# Altium schematic sheet Accelerometer.SchDoc: Motor Vibration
size A4; Organization: NTUST EE-305; Address1: No.43, Sec. 4, Keelung Rd.; Address2: Da’an Dist.; Address3: Taipei 106; Address4: Taiwan (R.O.C.); DocumentNumber: 2; Revision: 3.0; SheetNumber: 9; SheetTotal: 9
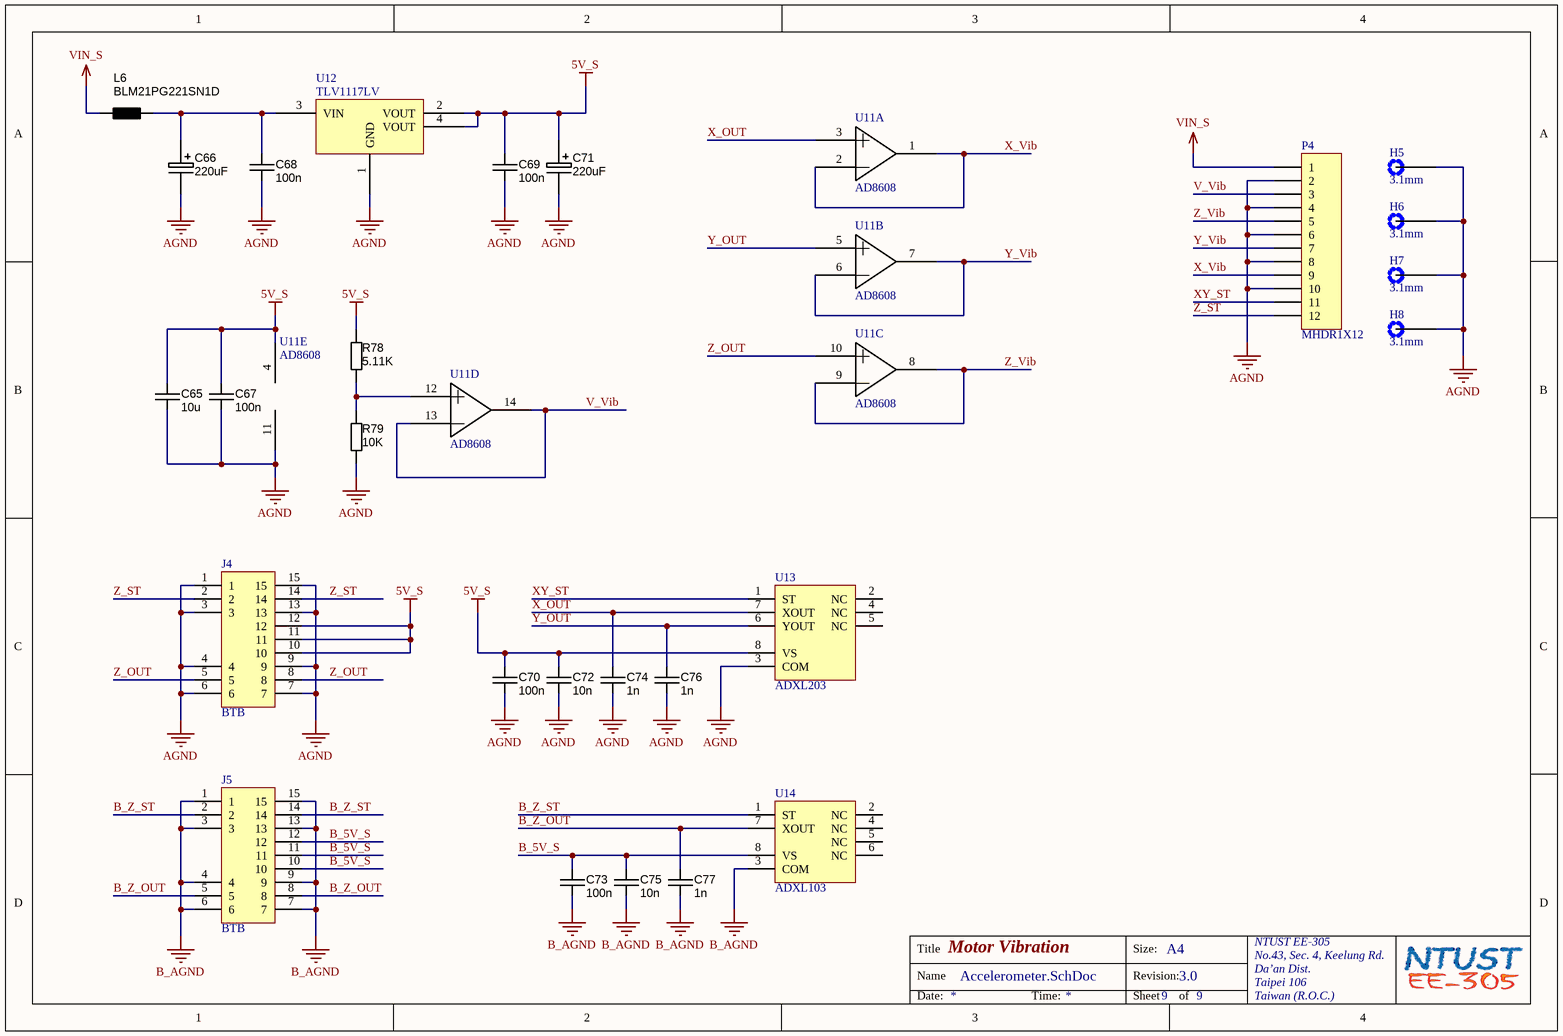
[diagram p0: Accelerometer.SchDoc]

## Parts
C65  10u  [CAPC1005N]
C66  220uF  [CAP_ELEC_SIZE_D8]
C67  100n  [CAPC1005N]
C68  100n  [CAPC1005N]
C69  100n  [CAPC1005N]
C70  100n  [CAPC1005N]
C71  220uF  [CAP_ELEC_SIZE_D8]
C72  10n  [CAPC1005N]
C73  100n  [CAPC1005N]
C74  1n  [CAPC1005N]
C75  10n  [CAPC1005N]
C76  1n  [CAPC1005N]
C77  1n  [CAPC1005N]
H5  3.1mm  [Holes]
H6  3.1mm  [Holes]
H7  3.1mm  [Holes]
H8  3.1mm  [Holes]
J4  BTB  [BTB_B]
J5  BTB  [BTB_S]
L6  BLM21PG221SN1D  [INDC2012N]
P4  MHDR1X12  [MHDR1X12]
R78  5.11K  [RESC1005N]
R79  10K  [RESC1005N]
U11  AD8608  [MCHP-TSSOP-ST14_L]  (parts A,B,C,D,E of 5)
U12  TLV1117LV  [SOT-223-DB3_N]
U13  ADXL203  [LCC8-E-8-1]
U14  ADXL103  [LCC8-E-8-1]

## Nets
5V_S: C65.1 C67.1 C69.1 C70.1 C71.1 C72.1 J4.10 J4.11 J4.12 R78.1 U11.4(VDD) U12.2(VOUT) U12.4(VOUT) U13.8(VS)
AGND: C65.2 C66.2 C67.2 C68.2 C69.2 C70.2 C71.2 C72.2 C74.2 C76.2 H5.0 H6.0 H7.0 H8.0 J4.1 J4.3 J4.4 J4.6 J4.7 J4.9 J4.13 J4.15 P4.2 P4.4 P4.6 P4.8 P4.10 R79.2 U11.11(GND) U12.1(GND) U13.3(COM)
B_AGND: C73.2 C75.2 C77.2 J5.1 J5.3 J5.4 J5.6 J5.7 J5.9 J5.13 J5.15 U14.3(COM)
VIN_S: L6.1 P4.1
B_5V_S: C73.1 C75.1 J5.10 J5.11 J5.12 U14.8(VS)
B_Z_OUT: C77.1 J5.5 J5.8 U14.7(XOUT)
B_Z_ST: J5.2 J5.14 U14.1(ST)
V_Vib: P4.3 U11.13(VIND-) U11.14(VOUTD)
X_OUT: C74.1 U11.3(VINA+) U13.7(XOUT)
X_Vib: P4.9 U11.1(VOUTA) U11.2(VINA-)
XY_ST: P4.11 U13.1(ST)
Y_OUT: C76.1 U11.5(VINB+) U13.6(YOUT)
Y_Vib: P4.7 U11.6(VINB-) U11.7(VOUTB)
Z_OUT: J4.5 J4.8 U11.10(VINC+)
Z_ST: J4.2 J4.14 P4.12
Z_Vib: P4.5 U11.8(VOUTC) U11.9(VINC-)
NetC66_1: C66.1 C68.1 L6.2 U12.3(VIN)
NetR78_2: R78.2 R79.1 U11.12(VIND+)

Not connected (* = marked no-connect by the designer): U13 2(NC) 4(NC) 5(NC); U14 2(NC) 4(NC) 5(NC) 6(NC)

## Notes on the sheet
- Title
- Name
- Size:
- Revision:
- A4
- Date:
- Time:
- Sheet
- of

## Library data of the parts
C65 = Capacitor SMD Cer X5R: Manufacturer 1: Kemet; Manufacturer Part Number 1: C0805C104K5RACTU; Tolerance: ?0%; Ratings: 50V; X7R; Material: ceramic; Package / Case: 0805 (2012 metric); Supplier 1: Digi-Key; Supplier Part Number 1: 399-1170-1-ND; Value: 10u
C66 C71 = Capacitor SMD Alum Elec: Ratings: 10V; 105蚓; Tolerance: ?0%; Material: Al; Package / Case: Radial - Surface Mount; Supplier 1: Digi-Key; Supplier Part Number 1: PCE4185CT-ND; Value: 220uF
C67-C70 C72 C73 C75 = Capacitor SMD Cer X7R: Manufacturer 1: Kemet; Manufacturer Part Number 1: C0805C104K5RACTU; Tolerance: ?0%; Ratings: 50V; X7R; Material: ceramic; Package / Case: 0805 (2012 metric); Supplier 1: Digi-Key; Supplier Part Number 1: 399-1170-1-ND
  C67-C70 C73: Value: 100n
  C72 C75: Value: 10n
C74 C76 C77 = Capacitor SMD Cer NPO: Manufacturer 1: Kemet; Manufacturer Part Number 1: C0805C104K5RACTU; Tolerance: ?0%; Ratings: 50V; X7R; Material: ceramic; Package / Case: 0805 (2012 metric); Supplier 1: Digi-Key; Supplier Part Number 1: 399-1170-1-ND; Value: 1n
H5-H8 = Holes: Mounting Holes
L6 = BLM21PG221SN1D: EMIFILr (Inductor type) Chip Ferrite Bead; Supplier 1: Digi-Key; Supplier Part Number 1: 490-1054-1-ND
P4 = MHDR1X12: Header, 12-Pin; LatestRevisionDate: 17-Jul-2002; LatestRevisionNote: Re-released for DXP Platform.; Publisher: Altium Limited
R78 R79 = Resistor SMD chip: Manufacturer 1: Yageo; Manufacturer Part Number 1: RC0805JR-0710KL; Ratings: 1/8 W; Tolerance: ?%; Package / Case: 0805 (2012 metric); Material: Thick Film; Supplier 1: Digi-Key; Supplier Part Number 1: 311-10KARCT-ND
  R78: Value: 5.11K
  R79: Value: 10K
U11 = AD8608: General Purpose Amplifier 4 Circuit Rail-to-Rail 14-TSSOP; Supplier 1: Digi-Key; Supplier 2: Digi-Key; Supplier 3: Digi-Key; Supplier 4: Digi-Key; Supplier Part Number 1: AD8608ARUZ-REELTR-ND; Supplier Part Number 2: AD8608ARUZ-ND; Supplier Part Number 3: AD8608ARUZ-REELDKR-ND; Supplier Part Number 4: AD8608ARUZ-REELCT-ND
U12 = TLV1117LV: 1-A, Positive Fixed-Voltage, Low-Dropout Regulator; Supplier 1: Digi-Key; Supplier Part Number 1: 296-28778-1-ND
U13 = ADXL203: Accelerometer X, Y Axis ±1.7g 0.5Hz ~ 2.5kHz 8-LCC (5x5); Supplier 1: Digi-Key; Supplier 2: Digi-Key; Supplier 3: Digi-Key; Supplier 4: Digi-Key; Supplier Part Number 1: ADXL203CE-REELDKR-ND; Supplier Part Number 2: ADXL203CE-ND; Supplier Part Number 3: ADXL203CE-REELTR-ND; Supplier Part Number 4: ADXL203CE-REELCT-ND
U14 = ADXL103: Accelerometer X Axis ±1.7g 0.5Hz ~ 2.5kHz 8-LCC (5x5); Supplier 1: Digi-Key; Supplier 2: Digi-Key; Supplier 3: Digi-Key; Supplier 4: Digi-Key; Supplier Part Number 1: ADXL103CE-REELDKR-ND; Supplier Part Number 2: ADXL103CE-REELCT-ND; Supplier Part Number 3: ADXL103CE-ND; Supplier Part Number 4: ADXL103CE-REELTR-ND